# Altium schematic sheet MotorDriver.SchDoc
size 381 x 241 mm
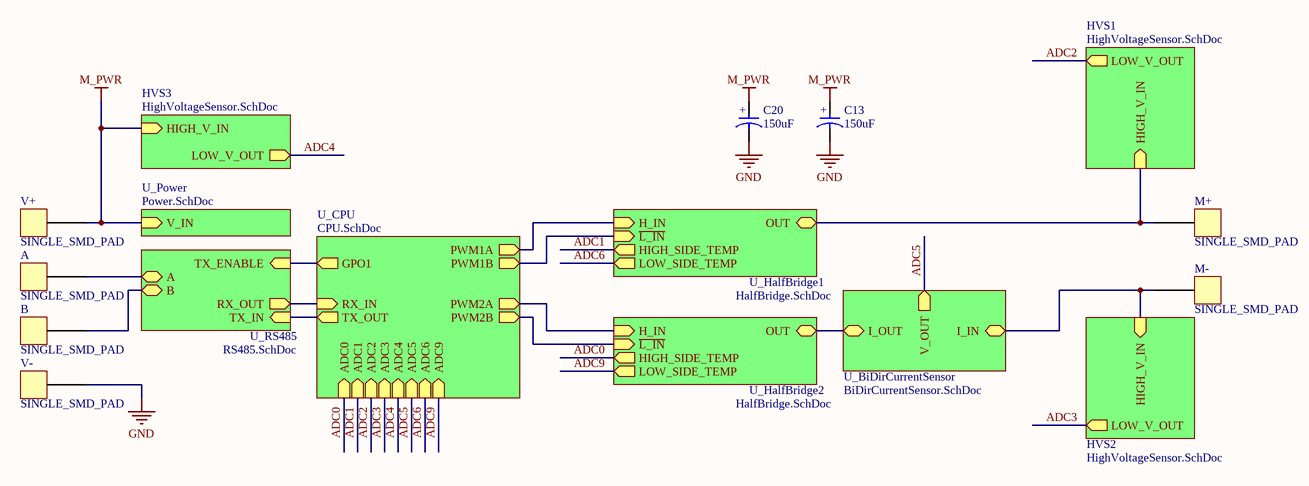
[diagram p0: MotorDriver.SchDoc]

## Parts
A  SINGLE_SMD_PAD  [SINGLE_SMD_PAD]
B  SINGLE_SMD_PAD  [SINGLE_SMD_PAD]
C13  value 150uF  [MAL202137151E3]  (hidden comment: MAL202137151E3)
C20  value 150uF  [MAL202137151E3]  (hidden comment: MAL202137151E3)
M+  SINGLE_SMD_PAD  [SINGLE_SMD_PAD]
M-  SINGLE_SMD_PAD  [SINGLE_SMD_PAD]
V+  SINGLE_SMD_PAD  [SINGLE_SMD_PAD]
V-  SINGLE_SMD_PAD  [SINGLE_SMD_PAD]

## Sub-sheets
HVS1 = HighVoltageSensor.SchDoc: HIGH_V_IN (in), LOW_V_OUT (out)
HVS2 = HighVoltageSensor.SchDoc: HIGH_V_IN (in), LOW_V_OUT (out)
HVS3 = HighVoltageSensor.SchDoc: HIGH_V_IN (in), LOW_V_OUT (out)
U_BiDirCurrentSensor = BiDirCurrentSensor.SchDoc: V_OUT (out), I_IN (bidir), I_OUT (bidir)
U_CPU = CPU.SchDoc: PWM2A (out), PWM2B (out), PWM1A (out), PWM1B (out), ADC1 (in), GPO1 (out), TX_OUT (out), RX_IN (in), ADC2 (in), ADC3 (in), ADC0 (in), ADC4 (in), ADC5 (in), ADC6 (in), ADC9 (in)
U_HalfBridge1 = HalfBridge.SchDoc: OUT (bidir), H_IN (in), ~{L_IN} (in), HIGH_SIDE_TEMP (out), LOW_SIDE_TEMP (out)
U_HalfBridge2 = HalfBridge.SchDoc: OUT (bidir), H_IN (in), ~{L_IN} (in), HIGH_SIDE_TEMP (out), LOW_SIDE_TEMP (out)
U_Power = Power.SchDoc: V_IN (in)
U_RS485 = RS485.SchDoc: RX_OUT (out), TX_IN (in), TX_ENABLE (in), A (bidir), B (bidir)

## Nets
GND: C13.- C20.- V-.0
M_PWR: C13.+ C20.+ V+.0 ; sheet U_Power/V_IN, sheet HVS3/HIGH_V_IN
ADC0: sheet U_CPU/ADC0, sheet U_HalfBridge2/HIGH_SIDE_TEMP
ADC1: sheet U_CPU/ADC1, sheet U_HalfBridge1/HIGH_SIDE_TEMP
ADC2: sheet U_CPU/ADC2, sheet HVS1/LOW_V_OUT
ADC3: sheet U_CPU/ADC3, sheet HVS2/LOW_V_OUT
ADC4: sheet U_CPU/ADC4, sheet HVS3/LOW_V_OUT
ADC5: sheet U_CPU/ADC5, sheet U_BiDirCurrentSensor/V_OUT
ADC6: sheet U_CPU/ADC6, sheet U_HalfBridge1/LOW_SIDE_TEMP
ADC9: sheet U_CPU/ADC9, sheet U_HalfBridge2/LOW_SIDE_TEMP
NetA_0: A.0 ; sheet U_RS485/A
NetB_0: B.0 ; sheet U_RS485/B
NetM+_0: M+.0 ; sheet U_HalfBridge1/OUT, sheet HVS1/HIGH_V_IN
NetM-_0: M-.0 ; sheet U_BiDirCurrentSensor/I_IN, sheet HVS2/HIGH_V_IN
(unnamed): sheet U_CPU/PWM2A, sheet U_HalfBridge2/H_IN
(unnamed): sheet U_CPU/PWM2B, sheet U_HalfBridge2/~{L_IN}
(unnamed): sheet U_CPU/PWM1A, sheet U_HalfBridge1/H_IN
(unnamed): sheet U_CPU/PWM1B, sheet U_HalfBridge1/~{L_IN}
(unnamed): sheet U_CPU/GPO1, sheet U_RS485/TX_ENABLE
(unnamed): sheet U_CPU/TX_OUT, sheet U_RS485/TX_IN
(unnamed): sheet U_CPU/RX_IN, sheet U_RS485/RX_OUT
(unnamed): sheet U_HalfBridge2/OUT, sheet U_BiDirCurrentSensor/I_OUT

## Library data of the parts
C13 C20 = MAL202137151E3: CAP ALUM 150UF 40V 20% AXIAL; Supplier 1: Digi-Key; Supplier Part Number 1: 4050PHCT-ND